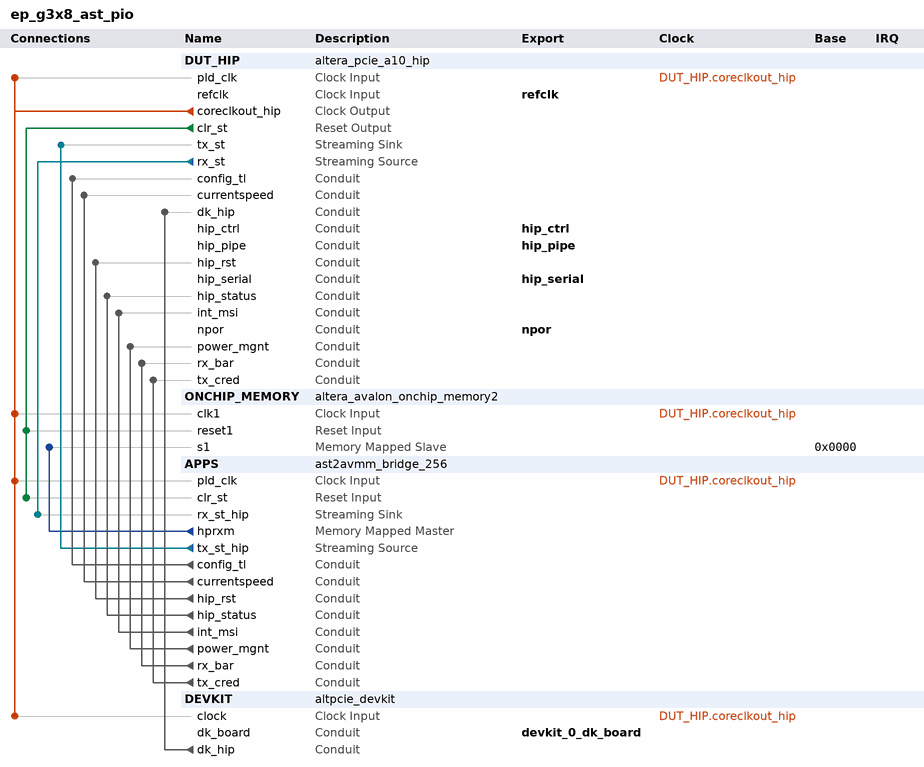
[diagram p0: system contents]
# Platform Designer (Qsys) system ep_g3x8_ast_pio, Arria 10 10AX115S1F45I1SG
# Parameters at their usual value, and those the tool derives, are not listed.
package require -exact qsys 17.0
create_system ep_g3x8_ast_pio
set_project_property DEVICE_FAMILY {Arria 10}
set_project_property DEVICE 10AX115S1F45I1SG

add_instance DUT_HIP altera_pcie_a10_hip 17.0
set_instance_parameter_value DUT_HIP adme_enable_hwtcl 0
set_instance_parameter_value DUT_HIP advance_error_reporting_hwtcl 0
set_instance_parameter_value DUT_HIP apps_type_hwtcl 0
set_instance_parameter_value DUT_HIP ari_support_hwtcl 0
set_instance_parameter_value DUT_HIP ast_trs_num_desc_hwtcl 16
set_instance_parameter_value DUT_HIP ast_trs_rxdata_width_hwtcl 256
set_instance_parameter_value DUT_HIP ast_trs_rxdesc_width_hwtcl 256
set_instance_parameter_value DUT_HIP ast_trs_rxmty_width_hwtcl 32
set_instance_parameter_value DUT_HIP ast_trs_txdata_width_hwtcl 256
set_instance_parameter_value DUT_HIP ast_trs_txdesc_width_hwtcl 256
set_instance_parameter_value DUT_HIP ast_trs_txmty_width_hwtcl 32
set_instance_parameter_value DUT_HIP ast_trs_txstatus_width_hwtcl 256
set_instance_parameter_value DUT_HIP avmm_addr_width_hwtcl 32
set_instance_parameter_value DUT_HIP bar0_address_width_hwtcl 0
set_instance_parameter_value DUT_HIP bar0_type_hwtcl Disabled
set_instance_parameter_value DUT_HIP bar1_address_width_hwtcl 0
set_instance_parameter_value DUT_HIP bar1_type_hwtcl Disabled
set_instance_parameter_value DUT_HIP bar2_address_width_hwtcl 12
set_instance_parameter_value DUT_HIP bar3_address_width_hwtcl 0
set_instance_parameter_value DUT_HIP bar3_type_hwtcl Disabled
set_instance_parameter_value DUT_HIP base_device NIGHTFURY5
set_instance_parameter_value DUT_HIP bfm_drive_interface_clk_hwtcl 1
set_instance_parameter_value DUT_HIP bfm_drive_interface_control_hwtcl 1
set_instance_parameter_value DUT_HIP bfm_drive_interface_npor_hwtcl 1
set_instance_parameter_value DUT_HIP bfm_drive_interface_pipe_hwtcl 1
set_instance_parameter_value DUT_HIP cg_a2p_addr_map_pass_thru_bits_hwtcl 20
set_instance_parameter_value DUT_HIP cg_enable_a2p_interrupt_hwtcl 1
set_instance_parameter_value DUT_HIP cg_enable_advanced_interrupt_hwtcl 0
set_instance_parameter_value DUT_HIP class_code_hwtcl 0
set_instance_parameter_value DUT_HIP completion_timeout_hwtcl NONE
set_instance_parameter_value DUT_HIP cseb_autonomous_hwtcl 0
set_instance_parameter_value DUT_HIP cseb_config_bypass_hwtcl 0
set_instance_parameter_value DUT_HIP design_environment_hwtcl QSYS
set_instance_parameter_value DUT_HIP devhide_support_hwtcl 0
set_instance_parameter_value DUT_HIP device_embedded_ep_support_hwtcl 0
set_instance_parameter_value DUT_HIP device_id_hwtcl 0
set_instance_parameter_value DUT_HIP dis_adapt 0
set_instance_parameter_value DUT_HIP dma_use_scfifo_ext_hwtcl 0
set_instance_parameter_value DUT_HIP ecrc_check_capable_hwtcl 0
set_instance_parameter_value DUT_HIP ecrc_gen_capable_hwtcl 0
set_instance_parameter_value DUT_HIP enable_ast_trs_hwtcl 0
set_instance_parameter_value DUT_HIP enable_avst_reset_hwtcl 1
set_instance_parameter_value DUT_HIP enable_custom_features_hwtcl 0
set_instance_parameter_value DUT_HIP enable_devkit_conduit_hwtcl 1
set_instance_parameter_value DUT_HIP enable_example_design_qii_hwtcl 0
set_instance_parameter_value DUT_HIP enable_example_design_sim_hwtcl 0
set_instance_parameter_value DUT_HIP enable_example_design_synth_hwtcl 0
set_instance_parameter_value DUT_HIP enable_example_design_tb_hwtcl 0
set_instance_parameter_value DUT_HIP enable_gen3phase2eq_timechange 0
set_instance_parameter_value DUT_HIP enable_hip_status_for_avmm_hwtcl 0
set_instance_parameter_value DUT_HIP enable_lmi_hwtcl 0
set_instance_parameter_value DUT_HIP enable_nobar_slection_hwtcl 0
set_instance_parameter_value DUT_HIP enable_rxm_burst_hwtcl 0
set_instance_parameter_value DUT_HIP enable_skp_det 0
set_instance_parameter_value DUT_HIP enable_soft_dfe 0
set_instance_parameter_value DUT_HIP export_fpll_output_to_top_level_hwtcl 0
set_instance_parameter_value DUT_HIP export_phy_input_to_top_level_hwtcl 0
set_instance_parameter_value DUT_HIP extended_tag_support_hwtcl 0
set_instance_parameter_value DUT_HIP flr_capability_user_hwtcl 0
set_instance_parameter_value DUT_HIP force_tag_checking_on_hwtcl 0
set_instance_parameter_value DUT_HIP gen3_coeff_1_hwtcl 9
set_instance_parameter_value DUT_HIP gen3_coeff_3_ber_meas_hwtcl 12ms
set_instance_parameter_value DUT_HIP interface_type_hwtcl Avalon-ST
set_instance_parameter_value DUT_HIP internal_controller_hwtcl 0
set_instance_parameter_value DUT_HIP link2csr_width_hwtcl 16
set_instance_parameter_value DUT_HIP maximum_payload_size_hwtcl 128
set_instance_parameter_value DUT_HIP part_trait_device 10AX115S1F45I1SG
set_instance_parameter_value DUT_HIP pf0_ats_invalidate_queue_depth_hwtcl 0
set_instance_parameter_value DUT_HIP pf0_bar0_prefetchable_hwtcl 1
set_instance_parameter_value DUT_HIP pf0_bar0_present_hwtcl 1
set_instance_parameter_value DUT_HIP pf0_bar0_size_hwtcl 12
set_instance_parameter_value DUT_HIP pf0_bar0_type_hwtcl 1
set_instance_parameter_value DUT_HIP pf0_bar1_prefetchable_hwtcl 1
set_instance_parameter_value DUT_HIP pf0_bar1_present_hwtcl 0
set_instance_parameter_value DUT_HIP pf0_bar1_size_hwtcl 12
set_instance_parameter_value DUT_HIP pf0_bar2_prefetchable_hwtcl 1
set_instance_parameter_value DUT_HIP pf0_bar2_present_hwtcl 0
set_instance_parameter_value DUT_HIP pf0_bar2_size_hwtcl 12
set_instance_parameter_value DUT_HIP pf0_bar2_type_hwtcl 1
set_instance_parameter_value DUT_HIP pf0_bar3_prefetchable_hwtcl 1
set_instance_parameter_value DUT_HIP pf0_bar3_present_hwtcl 0
set_instance_parameter_value DUT_HIP pf0_bar3_size_hwtcl 12
set_instance_parameter_value DUT_HIP pf0_bar4_prefetchable_hwtcl 1
set_instance_parameter_value DUT_HIP pf0_bar4_present_hwtcl 0
set_instance_parameter_value DUT_HIP pf0_bar4_size_hwtcl 12
set_instance_parameter_value DUT_HIP pf0_bar4_type_hwtcl 1
set_instance_parameter_value DUT_HIP pf0_bar5_prefetchable_hwtcl 1
set_instance_parameter_value DUT_HIP pf0_bar5_present_hwtcl 0
set_instance_parameter_value DUT_HIP pf0_bar5_size_hwtcl 12
set_instance_parameter_value DUT_HIP pf0_extra_bar_present_hwtcl 0
set_instance_parameter_value DUT_HIP pf0_extra_bar_size_hwtcl 12
set_instance_parameter_value DUT_HIP pf0_interrupt_pin_hwtcl inta
set_instance_parameter_value DUT_HIP pf0_intr_line_hwtcl 0
set_instance_parameter_value DUT_HIP pf0_msi_multi_message_capable_hwtcl 4
set_instance_parameter_value DUT_HIP pf0_msix_pba_bir_hwtcl 0
set_instance_parameter_value DUT_HIP pf0_msix_pba_offset_hwtcl 0
set_instance_parameter_value DUT_HIP pf0_msix_table_bir_hwtcl 0
set_instance_parameter_value DUT_HIP pf0_msix_table_offset_hwtcl 0
set_instance_parameter_value DUT_HIP pf0_msix_table_size_hwtcl 0
set_instance_parameter_value DUT_HIP pf0_subclass_code_hwtcl 0
set_instance_parameter_value DUT_HIP pf0_tph_dev_specific_mode_support_hwtcl 0
set_instance_parameter_value DUT_HIP pf0_tph_int_mode_support_hwtcl 0
set_instance_parameter_value DUT_HIP pf0_tph_st_table_location_hwtcl 0
set_instance_parameter_value DUT_HIP pf0_tph_st_table_size_hwtcl 63
set_instance_parameter_value DUT_HIP pf0_vf_bar0_prefetchable_hwtcl 1
set_instance_parameter_value DUT_HIP pf0_vf_bar0_present_hwtcl 0
set_instance_parameter_value DUT_HIP pf0_vf_bar0_size_hwtcl 12
set_instance_parameter_value DUT_HIP pf0_vf_bar0_type_hwtcl 1
set_instance_parameter_value DUT_HIP pf0_vf_bar1_prefetchable_hwtcl 1
set_instance_parameter_value DUT_HIP pf0_vf_bar1_present_hwtcl 0
set_instance_parameter_value DUT_HIP pf0_vf_bar1_size_hwtcl 12
set_instance_parameter_value DUT_HIP pf0_vf_bar2_prefetchable_hwtcl 1
set_instance_parameter_value DUT_HIP pf0_vf_bar2_present_hwtcl 0
set_instance_parameter_value DUT_HIP pf0_vf_bar2_size_hwtcl 12
set_instance_parameter_value DUT_HIP pf0_vf_bar2_type_hwtcl 1
set_instance_parameter_value DUT_HIP pf0_vf_bar3_prefetchable_hwtcl 1
set_instance_parameter_value DUT_HIP pf0_vf_bar3_present_hwtcl 0
set_instance_parameter_value DUT_HIP pf0_vf_bar3_size_hwtcl 12
set_instance_parameter_value DUT_HIP pf0_vf_bar4_prefetchable_hwtcl 1
set_instance_parameter_value DUT_HIP pf0_vf_bar4_present_hwtcl 0
set_instance_parameter_value DUT_HIP pf0_vf_bar4_size_hwtcl 12
set_instance_parameter_value DUT_HIP pf0_vf_bar4_type_hwtcl 1
set_instance_parameter_value DUT_HIP pf0_vf_bar5_prefetchable_hwtcl 1
set_instance_parameter_value DUT_HIP pf0_vf_bar5_present_hwtcl 0
set_instance_parameter_value DUT_HIP pf0_vf_bar5_size_hwtcl 12
set_instance_parameter_value DUT_HIP pf0_vf_count_user_hwtcl 0
set_instance_parameter_value DUT_HIP pf0_vf_device_id_hwtcl 0
set_instance_parameter_value DUT_HIP pf0_vf_msix_pba_bir_hwtcl 0
set_instance_parameter_value DUT_HIP pf0_vf_msix_pba_offset_hwtcl 0
set_instance_parameter_value DUT_HIP pf0_vf_msix_tbl_bir_hwtcl 0
set_instance_parameter_value DUT_HIP pf0_vf_msix_tbl_offset_hwtcl 0
set_instance_parameter_value DUT_HIP pf0_vf_msix_tbl_size_hwtcl 0
set_instance_parameter_value DUT_HIP pf0_vf_tph_dev_specific_mode_support_hwtcl 0
set_instance_parameter_value DUT_HIP pf0_vf_tph_int_mode_support_hwtcl 0
set_instance_parameter_value DUT_HIP pf0_vf_tph_st_table_location_hwtcl 0
set_instance_parameter_value DUT_HIP pf0_vf_tph_st_table_size_hwtcl 63
set_instance_parameter_value DUT_HIP pf1_ats_invalidate_queue_depth_hwtcl 0
set_instance_parameter_value DUT_HIP pf1_bar0_prefetchable_hwtcl 1
set_instance_parameter_value DUT_HIP pf1_bar0_present_hwtcl 0
set_instance_parameter_value DUT_HIP pf1_bar0_size_hwtcl 12
set_instance_parameter_value DUT_HIP pf1_bar0_type_hwtcl 1
set_instance_parameter_value DUT_HIP pf1_bar1_prefetchable_hwtcl 1
set_instance_parameter_value DUT_HIP pf1_bar1_present_hwtcl 0
set_instance_parameter_value DUT_HIP pf1_bar1_size_hwtcl 12
set_instance_parameter_value DUT_HIP pf1_bar2_prefetchable_hwtcl 1
set_instance_parameter_value DUT_HIP pf1_bar2_present_hwtcl 0
set_instance_parameter_value DUT_HIP pf1_bar2_size_hwtcl 12
set_instance_parameter_value DUT_HIP pf1_bar2_type_hwtcl 1
set_instance_parameter_value DUT_HIP pf1_bar3_prefetchable_hwtcl 1
set_instance_parameter_value DUT_HIP pf1_bar3_present_hwtcl 0
set_instance_parameter_value DUT_HIP pf1_bar3_size_hwtcl 12
set_instance_parameter_value DUT_HIP pf1_bar4_prefetchable_hwtcl 1
set_instance_parameter_value DUT_HIP pf1_bar4_present_hwtcl 0
set_instance_parameter_value DUT_HIP pf1_bar4_size_hwtcl 12
set_instance_parameter_value DUT_HIP pf1_bar4_type_hwtcl 1
set_instance_parameter_value DUT_HIP pf1_bar5_prefetchable_hwtcl 1
set_instance_parameter_value DUT_HIP pf1_bar5_present_hwtcl 0
set_instance_parameter_value DUT_HIP pf1_bar5_size_hwtcl 12
set_instance_parameter_value DUT_HIP pf1_class_code_hwtcl 0
set_instance_parameter_value DUT_HIP pf1_device_id_hwtcl 0
set_instance_parameter_value DUT_HIP pf1_interrupt_pin_hwtcl inta
set_instance_parameter_value DUT_HIP pf1_intr_line_hwtcl 0
set_instance_parameter_value DUT_HIP pf1_msi_multi_message_capable_hwtcl 4
set_instance_parameter_value DUT_HIP pf1_msix_pba_bir_hwtcl 0
set_instance_parameter_value DUT_HIP pf1_msix_pba_offset_hwtcl 0
set_instance_parameter_value DUT_HIP pf1_msix_table_bir_hwtcl 0
set_instance_parameter_value DUT_HIP pf1_msix_table_offset_hwtcl 0
set_instance_parameter_value DUT_HIP pf1_msix_table_size_hwtcl 0
set_instance_parameter_value DUT_HIP pf1_revision_id_hwtcl 0
set_instance_parameter_value DUT_HIP pf1_subclass_code_hwtcl 0
set_instance_parameter_value DUT_HIP pf1_subsystem_device_id_hwtcl 0
set_instance_parameter_value DUT_HIP pf1_subsystem_vendor_id_hwtcl 0
set_instance_parameter_value DUT_HIP pf1_tph_dev_specific_mode_support_hwtcl 0
set_instance_parameter_value DUT_HIP pf1_tph_int_mode_support_hwtcl 0
set_instance_parameter_value DUT_HIP pf1_tph_st_table_location_hwtcl 0
set_instance_parameter_value DUT_HIP pf1_tph_st_table_size_hwtcl 63
set_instance_parameter_value DUT_HIP pf1_vendor_id_hwtcl 0
set_instance_parameter_value DUT_HIP pf1_vf_bar0_prefetchable_hwtcl 1
set_instance_parameter_value DUT_HIP pf1_vf_bar0_present_hwtcl 0
set_instance_parameter_value DUT_HIP pf1_vf_bar0_size_hwtcl 12
set_instance_parameter_value DUT_HIP pf1_vf_bar0_type_hwtcl 1
set_instance_parameter_value DUT_HIP pf1_vf_bar1_prefetchable_hwtcl 1
set_instance_parameter_value DUT_HIP pf1_vf_bar1_present_hwtcl 0
set_instance_parameter_value DUT_HIP pf1_vf_bar1_size_hwtcl 12
set_instance_parameter_value DUT_HIP pf1_vf_bar2_prefetchable_hwtcl 1
set_instance_parameter_value DUT_HIP pf1_vf_bar2_present_hwtcl 0
set_instance_parameter_value DUT_HIP pf1_vf_bar2_size_hwtcl 12
set_instance_parameter_value DUT_HIP pf1_vf_bar2_type_hwtcl 1
set_instance_parameter_value DUT_HIP pf1_vf_bar3_prefetchable_hwtcl 1
set_instance_parameter_value DUT_HIP pf1_vf_bar3_present_hwtcl 0
set_instance_parameter_value DUT_HIP pf1_vf_bar3_size_hwtcl 12
set_instance_parameter_value DUT_HIP pf1_vf_bar4_prefetchable_hwtcl 1
set_instance_parameter_value DUT_HIP pf1_vf_bar4_present_hwtcl 0
set_instance_parameter_value DUT_HIP pf1_vf_bar4_size_hwtcl 12
set_instance_parameter_value DUT_HIP pf1_vf_bar4_type_hwtcl 1
set_instance_parameter_value DUT_HIP pf1_vf_bar5_prefetchable_hwtcl 1
set_instance_parameter_value DUT_HIP pf1_vf_bar5_present_hwtcl 0
set_instance_parameter_value DUT_HIP pf1_vf_bar5_size_hwtcl 12
set_instance_parameter_value DUT_HIP pf1_vf_count_user_hwtcl 0
set_instance_parameter_value DUT_HIP pf1_vf_device_id_hwtcl 0
set_instance_parameter_value DUT_HIP pf1_vf_msix_pba_bir_hwtcl 0
set_instance_parameter_value DUT_HIP pf1_vf_msix_pba_offset_hwtcl 0
set_instance_parameter_value DUT_HIP pf1_vf_msix_tbl_bir_hwtcl 0
set_instance_parameter_value DUT_HIP pf1_vf_msix_tbl_offset_hwtcl 0
set_instance_parameter_value DUT_HIP pf1_vf_msix_tbl_size_hwtcl 0
set_instance_parameter_value DUT_HIP pf1_vf_tph_dev_specific_mode_support_hwtcl 0
set_instance_parameter_value DUT_HIP pf1_vf_tph_int_mode_support_hwtcl 0
set_instance_parameter_value DUT_HIP pf1_vf_tph_st_table_location_hwtcl 0
set_instance_parameter_value DUT_HIP pf1_vf_tph_st_table_size_hwtcl 63
set_instance_parameter_value DUT_HIP pf2_ats_invalidate_queue_depth_hwtcl 0
set_instance_parameter_value DUT_HIP pf2_bar0_prefetchable_hwtcl 1
set_instance_parameter_value DUT_HIP pf2_bar0_present_hwtcl 0
set_instance_parameter_value DUT_HIP pf2_bar0_size_hwtcl 12
set_instance_parameter_value DUT_HIP pf2_bar0_type_hwtcl 1
set_instance_parameter_value DUT_HIP pf2_bar1_prefetchable_hwtcl 1
set_instance_parameter_value DUT_HIP pf2_bar1_present_hwtcl 0
set_instance_parameter_value DUT_HIP pf2_bar1_size_hwtcl 12
set_instance_parameter_value DUT_HIP pf2_bar2_prefetchable_hwtcl 1
set_instance_parameter_value DUT_HIP pf2_bar2_present_hwtcl 0
set_instance_parameter_value DUT_HIP pf2_bar2_size_hwtcl 12
set_instance_parameter_value DUT_HIP pf2_bar2_type_hwtcl 1
set_instance_parameter_value DUT_HIP pf2_bar3_prefetchable_hwtcl 1
set_instance_parameter_value DUT_HIP pf2_bar3_present_hwtcl 0
set_instance_parameter_value DUT_HIP pf2_bar3_size_hwtcl 12
set_instance_parameter_value DUT_HIP pf2_bar4_prefetchable_hwtcl 1
set_instance_parameter_value DUT_HIP pf2_bar4_present_hwtcl 0
set_instance_parameter_value DUT_HIP pf2_bar4_size_hwtcl 12
set_instance_parameter_value DUT_HIP pf2_bar4_type_hwtcl 1
set_instance_parameter_value DUT_HIP pf2_bar5_prefetchable_hwtcl 1
set_instance_parameter_value DUT_HIP pf2_bar5_present_hwtcl 0
set_instance_parameter_value DUT_HIP pf2_bar5_size_hwtcl 12
set_instance_parameter_value DUT_HIP pf2_class_code_hwtcl 0
set_instance_parameter_value DUT_HIP pf2_device_id_hwtcl 0
set_instance_parameter_value DUT_HIP pf2_interrupt_pin_hwtcl inta
set_instance_parameter_value DUT_HIP pf2_intr_line_hwtcl 0
set_instance_parameter_value DUT_HIP pf2_msi_multi_message_capable_hwtcl 4
set_instance_parameter_value DUT_HIP pf2_msix_pba_bir_hwtcl 0
set_instance_parameter_value DUT_HIP pf2_msix_pba_offset_hwtcl 0
set_instance_parameter_value DUT_HIP pf2_msix_table_bir_hwtcl 0
set_instance_parameter_value DUT_HIP pf2_msix_table_offset_hwtcl 0
set_instance_parameter_value DUT_HIP pf2_msix_table_size_hwtcl 0
set_instance_parameter_value DUT_HIP pf2_revision_id_hwtcl 0
set_instance_parameter_value DUT_HIP pf2_subclass_code_hwtcl 0
set_instance_parameter_value DUT_HIP pf2_subsystem_device_id_hwtcl 0
set_instance_parameter_value DUT_HIP pf2_subsystem_vendor_id_hwtcl 0
set_instance_parameter_value DUT_HIP pf2_tph_dev_specific_mode_support_hwtcl 0
set_instance_parameter_value DUT_HIP pf2_tph_int_mode_support_hwtcl 0
set_instance_parameter_value DUT_HIP pf2_tph_st_table_location_hwtcl 0
set_instance_parameter_value DUT_HIP pf2_tph_st_table_size_hwtcl 63
set_instance_parameter_value DUT_HIP pf2_vendor_id_hwtcl 0
set_instance_parameter_value DUT_HIP pf2_vf_bar0_prefetchable_hwtcl 1
set_instance_parameter_value DUT_HIP pf2_vf_bar0_present_hwtcl 0
set_instance_parameter_value DUT_HIP pf2_vf_bar0_size_hwtcl 12
set_instance_parameter_value DUT_HIP pf2_vf_bar0_type_hwtcl 1
set_instance_parameter_value DUT_HIP pf2_vf_bar1_prefetchable_hwtcl 1
set_instance_parameter_value DUT_HIP pf2_vf_bar1_present_hwtcl 0
set_instance_parameter_value DUT_HIP pf2_vf_bar1_size_hwtcl 12
set_instance_parameter_value DUT_HIP pf2_vf_bar2_prefetchable_hwtcl 1
set_instance_parameter_value DUT_HIP pf2_vf_bar2_present_hwtcl 0
set_instance_parameter_value DUT_HIP pf2_vf_bar2_size_hwtcl 12
set_instance_parameter_value DUT_HIP pf2_vf_bar2_type_hwtcl 1
set_instance_parameter_value DUT_HIP pf2_vf_bar3_prefetchable_hwtcl 1
set_instance_parameter_value DUT_HIP pf2_vf_bar3_present_hwtcl 0
set_instance_parameter_value DUT_HIP pf2_vf_bar3_size_hwtcl 12
set_instance_parameter_value DUT_HIP pf2_vf_bar4_prefetchable_hwtcl 1
set_instance_parameter_value DUT_HIP pf2_vf_bar4_present_hwtcl 0
set_instance_parameter_value DUT_HIP pf2_vf_bar4_size_hwtcl 12
set_instance_parameter_value DUT_HIP pf2_vf_bar4_type_hwtcl 1
set_instance_parameter_value DUT_HIP pf2_vf_bar5_prefetchable_hwtcl 1
set_instance_parameter_value DUT_HIP pf2_vf_bar5_present_hwtcl 0
set_instance_parameter_value DUT_HIP pf2_vf_bar5_size_hwtcl 12
set_instance_parameter_value DUT_HIP pf2_vf_count_user_hwtcl 0
set_instance_parameter_value DUT_HIP pf2_vf_device_id_hwtcl 0
set_instance_parameter_value DUT_HIP pf2_vf_msix_pba_bir_hwtcl 0
set_instance_parameter_value DUT_HIP pf2_vf_msix_pba_offset_hwtcl 0
set_instance_parameter_value DUT_HIP pf2_vf_msix_tbl_bir_hwtcl 0
set_instance_parameter_value DUT_HIP pf2_vf_msix_tbl_offset_hwtcl 0
set_instance_parameter_value DUT_HIP pf2_vf_msix_tbl_size_hwtcl 0
set_instance_parameter_value DUT_HIP pf2_vf_tph_dev_specific_mode_support_hwtcl 0
set_instance_parameter_value DUT_HIP pf2_vf_tph_int_mode_support_hwtcl 0
set_instance_parameter_value DUT_HIP pf2_vf_tph_st_table_location_hwtcl 0
set_instance_parameter_value DUT_HIP pf2_vf_tph_st_table_size_hwtcl 63
set_instance_parameter_value DUT_HIP pf3_ats_invalidate_queue_depth_hwtcl 0
set_instance_parameter_value DUT_HIP pf3_bar0_prefetchable_hwtcl 1
set_instance_parameter_value DUT_HIP pf3_bar0_present_hwtcl 0
set_instance_parameter_value DUT_HIP pf3_bar0_size_hwtcl 12
set_instance_parameter_value DUT_HIP pf3_bar0_type_hwtcl 1
set_instance_parameter_value DUT_HIP pf3_bar1_prefetchable_hwtcl 1
set_instance_parameter_value DUT_HIP pf3_bar1_present_hwtcl 0
set_instance_parameter_value DUT_HIP pf3_bar1_size_hwtcl 12
set_instance_parameter_value DUT_HIP pf3_bar2_prefetchable_hwtcl 1
set_instance_parameter_value DUT_HIP pf3_bar2_present_hwtcl 0
set_instance_parameter_value DUT_HIP pf3_bar2_size_hwtcl 12
set_instance_parameter_value DUT_HIP pf3_bar2_type_hwtcl 1
set_instance_parameter_value DUT_HIP pf3_bar3_prefetchable_hwtcl 1
set_instance_parameter_value DUT_HIP pf3_bar3_present_hwtcl 0
set_instance_parameter_value DUT_HIP pf3_bar3_size_hwtcl 12
set_instance_parameter_value DUT_HIP pf3_bar4_prefetchable_hwtcl 1
set_instance_parameter_value DUT_HIP pf3_bar4_present_hwtcl 0
set_instance_parameter_value DUT_HIP pf3_bar4_size_hwtcl 12
set_instance_parameter_value DUT_HIP pf3_bar4_type_hwtcl 1
set_instance_parameter_value DUT_HIP pf3_bar5_prefetchable_hwtcl 1
set_instance_parameter_value DUT_HIP pf3_bar5_present_hwtcl 0
set_instance_parameter_value DUT_HIP pf3_bar5_size_hwtcl 12
set_instance_parameter_value DUT_HIP pf3_class_code_hwtcl 0
set_instance_parameter_value DUT_HIP pf3_device_id_hwtcl 0
set_instance_parameter_value DUT_HIP pf3_interrupt_pin_hwtcl inta
set_instance_parameter_value DUT_HIP pf3_intr_line_hwtcl 0
set_instance_parameter_value DUT_HIP pf3_msi_multi_message_capable_hwtcl 4
set_instance_parameter_value DUT_HIP pf3_msix_pba_bir_hwtcl 0
set_instance_parameter_value DUT_HIP pf3_msix_pba_offset_hwtcl 0
set_instance_parameter_value DUT_HIP pf3_msix_table_bir_hwtcl 0
set_instance_parameter_value DUT_HIP pf3_msix_table_offset_hwtcl 0
set_instance_parameter_value DUT_HIP pf3_msix_table_size_hwtcl 0
set_instance_parameter_value DUT_HIP pf3_revision_id_hwtcl 0
set_instance_parameter_value DUT_HIP pf3_subclass_code_hwtcl 0
set_instance_parameter_value DUT_HIP pf3_subsystem_device_id_hwtcl 0
set_instance_parameter_value DUT_HIP pf3_subsystem_vendor_id_hwtcl 0
set_instance_parameter_value DUT_HIP pf3_tph_dev_specific_mode_support_hwtcl 0
set_instance_parameter_value DUT_HIP pf3_tph_int_mode_support_hwtcl 0
set_instance_parameter_value DUT_HIP pf3_tph_st_table_location_hwtcl 0
set_instance_parameter_value DUT_HIP pf3_tph_st_table_size_hwtcl 63
set_instance_parameter_value DUT_HIP pf3_vendor_id_hwtcl 0
set_instance_parameter_value DUT_HIP pf3_vf_bar0_prefetchable_hwtcl 1
set_instance_parameter_value DUT_HIP pf3_vf_bar0_present_hwtcl 0
set_instance_parameter_value DUT_HIP pf3_vf_bar0_size_hwtcl 12
set_instance_parameter_value DUT_HIP pf3_vf_bar0_type_hwtcl 1
set_instance_parameter_value DUT_HIP pf3_vf_bar1_prefetchable_hwtcl 1
set_instance_parameter_value DUT_HIP pf3_vf_bar1_present_hwtcl 0
set_instance_parameter_value DUT_HIP pf3_vf_bar1_size_hwtcl 12
set_instance_parameter_value DUT_HIP pf3_vf_bar2_prefetchable_hwtcl 1
set_instance_parameter_value DUT_HIP pf3_vf_bar2_present_hwtcl 0
set_instance_parameter_value DUT_HIP pf3_vf_bar2_size_hwtcl 12
set_instance_parameter_value DUT_HIP pf3_vf_bar2_type_hwtcl 1
set_instance_parameter_value DUT_HIP pf3_vf_bar3_prefetchable_hwtcl 1
set_instance_parameter_value DUT_HIP pf3_vf_bar3_present_hwtcl 0
set_instance_parameter_value DUT_HIP pf3_vf_bar3_size_hwtcl 12
set_instance_parameter_value DUT_HIP pf3_vf_bar4_prefetchable_hwtcl 1
set_instance_parameter_value DUT_HIP pf3_vf_bar4_present_hwtcl 0
set_instance_parameter_value DUT_HIP pf3_vf_bar4_size_hwtcl 12
set_instance_parameter_value DUT_HIP pf3_vf_bar4_type_hwtcl 1
set_instance_parameter_value DUT_HIP pf3_vf_bar5_prefetchable_hwtcl 1
set_instance_parameter_value DUT_HIP pf3_vf_bar5_present_hwtcl 0
set_instance_parameter_value DUT_HIP pf3_vf_bar5_size_hwtcl 12
set_instance_parameter_value DUT_HIP pf3_vf_count_user_hwtcl 0
set_instance_parameter_value DUT_HIP pf3_vf_device_id_hwtcl 0
set_instance_parameter_value DUT_HIP pf3_vf_msix_pba_bir_hwtcl 0
set_instance_parameter_value DUT_HIP pf3_vf_msix_pba_offset_hwtcl 0
set_instance_parameter_value DUT_HIP pf3_vf_msix_tbl_bir_hwtcl 0
set_instance_parameter_value DUT_HIP pf3_vf_msix_tbl_offset_hwtcl 0
set_instance_parameter_value DUT_HIP pf3_vf_msix_tbl_size_hwtcl 0
set_instance_parameter_value DUT_HIP pf3_vf_tph_dev_specific_mode_support_hwtcl 0
set_instance_parameter_value DUT_HIP pf3_vf_tph_int_mode_support_hwtcl 0
set_instance_parameter_value DUT_HIP pf3_vf_tph_st_table_location_hwtcl 0
set_instance_parameter_value DUT_HIP pf3_vf_tph_st_table_size_hwtcl 63
set_instance_parameter_value DUT_HIP pf_ats_support_hwtcl 0
set_instance_parameter_value DUT_HIP pf_enable_function_msix_support_hwtcl 0
set_instance_parameter_value DUT_HIP pf_msi_support_hwtcl 0
set_instance_parameter_value DUT_HIP pf_tph_support_hwtcl 0
set_instance_parameter_value DUT_HIP reserved_debug_hwtcl 0
set_instance_parameter_value DUT_HIP revision_id_hwtcl 0
set_instance_parameter_value DUT_HIP rx_buffer_credit_alloc_hwtcl Low
set_instance_parameter_value DUT_HIP rx_cred_ctl_param_hwtcl 0
set_instance_parameter_value DUT_HIP rx_polinv_soft_logic_enable 0
set_instance_parameter_value DUT_HIP select_design_example_hwtcl PIO
set_instance_parameter_value DUT_HIP select_design_example_rtl_lang_hwtcl Verilog
set_instance_parameter_value DUT_HIP slave_address_map_0_hwtcl 0
set_instance_parameter_value DUT_HIP slave_address_map_2_hprxm_hwtcl 0
set_instance_parameter_value DUT_HIP slave_address_map_2_hwtcl 0
set_instance_parameter_value DUT_HIP slot_clock_cfg_hwtcl 1
set_instance_parameter_value DUT_HIP speed_change_hwtcl 0
set_instance_parameter_value DUT_HIP sr_iov_support_hwtcl 0
set_instance_parameter_value DUT_HIP sriov2_en 0
set_instance_parameter_value DUT_HIP subsystem_device_id_hwtcl 0
set_instance_parameter_value DUT_HIP subsystem_vendor_id_hwtcl 0
set_instance_parameter_value DUT_HIP system_page_sizes_supported_hwtcl 1363
set_instance_parameter_value DUT_HIP targeted_devkit_hwtcl {Arria 10 GX FPGA Development Kit}
set_instance_parameter_value DUT_HIP test_cseb_switch_hwtcl 0
set_instance_parameter_value DUT_HIP tlp_insp_trg_dw0_hwtcl 2049
set_instance_parameter_value DUT_HIP tlp_insp_trg_dw1_hwtcl 0
set_instance_parameter_value DUT_HIP tlp_insp_trg_dw2_hwtcl 0
set_instance_parameter_value DUT_HIP tlp_inspector_hwtcl 0
set_instance_parameter_value DUT_HIP tlp_inspector_use_signal_probe_hwtcl 0
set_instance_parameter_value DUT_HIP tlp_inspector_use_thin_rx_master 0
set_instance_parameter_value DUT_HIP total_pf_count_hwtcl 1
set_instance_parameter_value DUT_HIP use_dynamic_design_example_hwtcl 1
set_instance_parameter_value DUT_HIP use_rpbfm_pro 0
set_instance_parameter_value DUT_HIP user_id_hwtcl 0
set_instance_parameter_value DUT_HIP user_txs_addr_width_hwtcl 32
set_instance_parameter_value DUT_HIP vendor_id_hwtcl 4466
set_instance_parameter_value DUT_HIP vf_ats_support_hwtcl 0
set_instance_parameter_value DUT_HIP vf_msix_cap_present_hwtcl 0
set_instance_parameter_value DUT_HIP vf_tph_support_hwtcl 0
set_instance_parameter_value DUT_HIP vsec_cap_hwtcl 0
set_instance_parameter_value DUT_HIP vsec_id_hwtcl 4466
set_instance_parameter_value DUT_HIP wrala_hwtcl 0
set_instance_parameter_value DUT_HIP xcvr_reconfig_hwtcl 0

add_instance ONCHIP_MEMORY altera_avalon_onchip_memory2 17.0
set_instance_parameter_value ONCHIP_MEMORY dataWidth 256
set_instance_parameter_value ONCHIP_MEMORY dualPort false
set_instance_parameter_value ONCHIP_MEMORY initMemContent false
set_instance_parameter_value ONCHIP_MEMORY initializationFileName onchip_mem.hex
set_instance_parameter_value ONCHIP_MEMORY memorySize 4096

add_instance APPS ast2avmm_bridge_256 17.0
set_instance_parameter_value APPS BAR_NUMBER 2
set_instance_parameter_value APPS BAR_SIZE_MASK 12
set_instance_parameter_value APPS BAR_TYPE 0
set_instance_parameter_value APPS BURST_COUNT_WIDTH 6
set_instance_parameter_value APPS CUSTOM_FEATURE 0
set_instance_parameter_value APPS DBUS_WIDTH 256
set_instance_parameter_value APPS ENABLE_CRA 0
set_instance_parameter_value APPS ENABLE_TXS 0
set_instance_parameter_value APPS PF0_VF_COUNT_USER 1
set_instance_parameter_value APPS PF1_VF_COUNT_USER 1
set_instance_parameter_value APPS PF2_VF_COUNT_USER 1
set_instance_parameter_value APPS PF3_VF_COUNT_USER 1
set_instance_parameter_value APPS PF_COUNT 4
set_instance_parameter_value APPS PORT_TYPE {Native endpoint}
set_instance_parameter_value APPS SRIOV_EN 0
set_instance_parameter_value APPS TX_S_ADDR_WIDTH 32
set_instance_parameter_value APPS pcie_qsys 1

add_instance DEVKIT altpcie_devkit 17.0

# connections
add_connection DUT_HIP.coreclkout_hip APPS.pld_clk clock
add_connection DUT_HIP.coreclkout_hip DEVKIT.clock clock
add_connection DUT_HIP.coreclkout_hip DUT_HIP.pld_clk clock
add_connection DUT_HIP.coreclkout_hip ONCHIP_MEMORY.clk1 clock
add_connection DUT_HIP.clr_st APPS.clr_st reset
add_connection DUT_HIP.clr_st ONCHIP_MEMORY.reset1 reset
add_connection APPS.hprxm ONCHIP_MEMORY.s1 avalon
set_connection_parameter_value APPS.hprxm/ONCHIP_MEMORY.s1 baseAddress 0x0000
add_connection APPS.tx_st_hip DUT_HIP.tx_st avalon_streaming
add_connection DUT_HIP.rx_st APPS.rx_st_hip avalon_streaming
add_connection APPS.config_tl DUT_HIP.config_tl conduit
add_connection APPS.currentspeed DUT_HIP.currentspeed conduit
add_connection APPS.hip_rst DUT_HIP.hip_rst conduit
add_connection APPS.hip_status DUT_HIP.hip_status conduit
add_connection APPS.int_msi DUT_HIP.int_msi conduit
add_connection APPS.power_mgnt DUT_HIP.power_mgnt conduit
add_connection APPS.rx_bar DUT_HIP.rx_bar conduit
add_connection APPS.tx_cred DUT_HIP.tx_cred conduit
add_connection DEVKIT.dk_hip DUT_HIP.dk_hip conduit

# exported interfaces
add_interface devkit_0_dk_board conduit end
set_interface_property devkit_0_dk_board EXPORT_OF DEVKIT.dk_board
add_interface hip_ctrl conduit end
set_interface_property hip_ctrl EXPORT_OF DUT_HIP.hip_ctrl
add_interface hip_pipe conduit end
set_interface_property hip_pipe EXPORT_OF DUT_HIP.hip_pipe
add_interface hip_serial conduit end
set_interface_property hip_serial EXPORT_OF DUT_HIP.hip_serial
add_interface npor conduit end
set_interface_property npor EXPORT_OF DUT_HIP.npor
add_interface refclk clock sink
set_interface_property refclk EXPORT_OF DUT_HIP.refclk

set_interconnect_requirement {$system} qsys_mm.clockCrossingAdapter HANDSHAKE
set_interconnect_requirement {$system} qsys_mm.enableEccProtection FALSE
set_interconnect_requirement {$system} qsys_mm.insertDefaultSlave FALSE
set_interconnect_requirement {$system} qsys_mm.maxAdditionalLatency 1

save_system ep_g3x8_ast_pio.qsys
